# EAGLE schematic SELE_PROJECT (EAGLE 9.2.2)
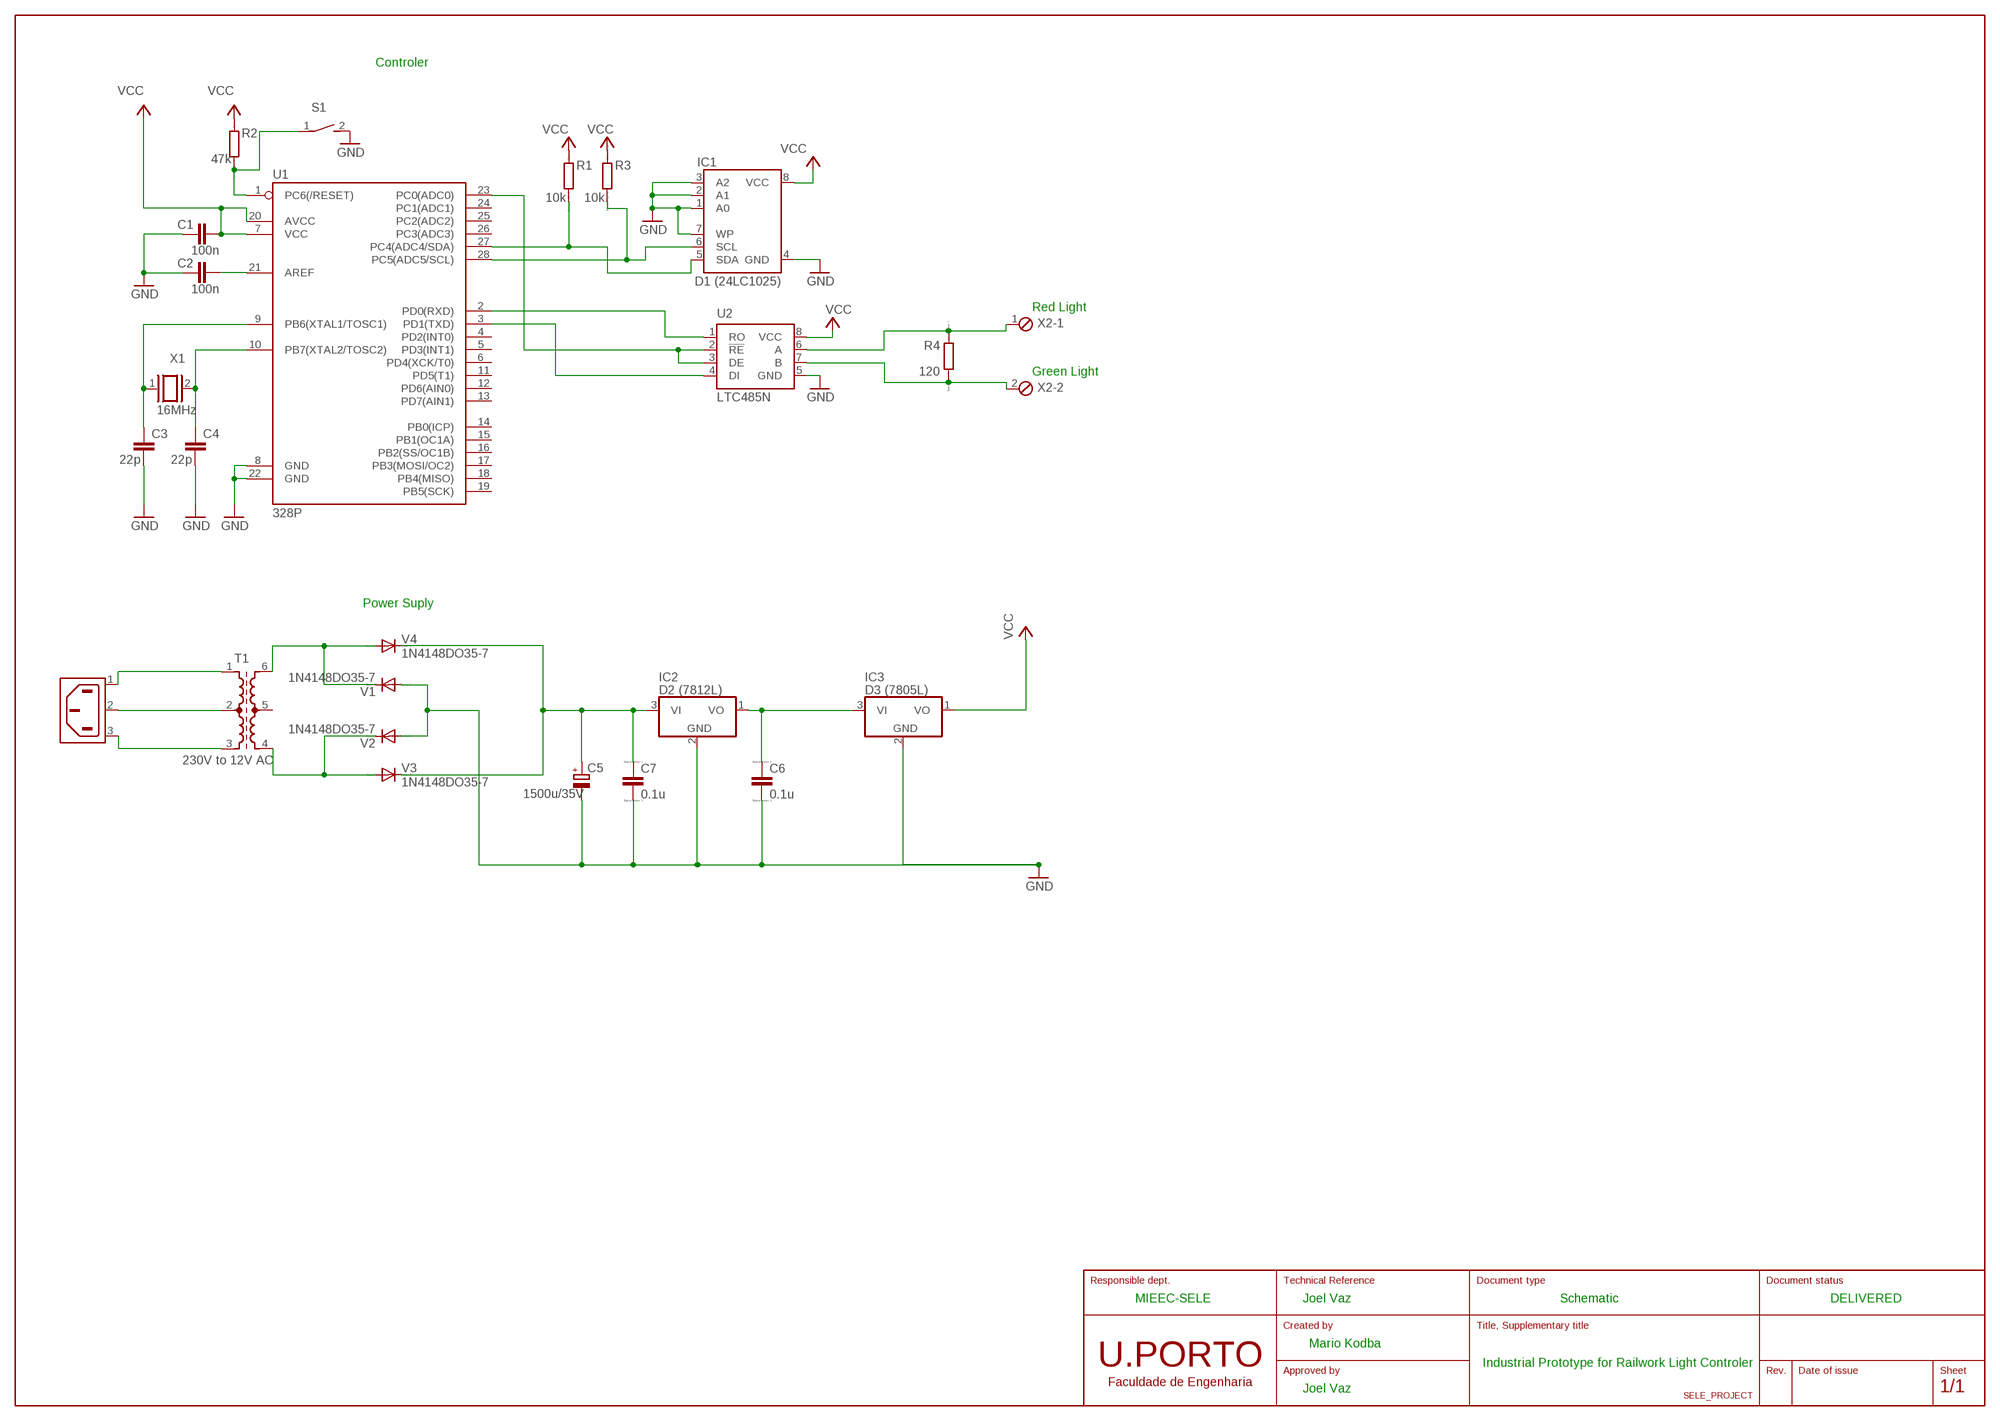
[diagram p0: schematic, sheet 1]

## Parts
C1  100n  C2,5-3  [C2.5-3]
C2  100n  C2,5-3  [C2.5-3]
C3  22p  C2,5-3  [C2.5-3]
C4  22p  C2,5-3  [C2.5-3]
C5  1500u/35V  CPOL-EU150CLZ-1010  [150CLZ-1010]
C6  0.1u  CC1210  [C1210]
C7  0.1u  CC1210  [C1210]
IC1  D1 (24LC1025)  AT24CP  [DIL08]
IC2  D2 (7812L)  7812L  [TO92]
IC3  D3 (7805L)  7805L  [TO92]
R1  10k  R  [R0805]
R2  47k  R  [R0805]
R3  10k  R  [R0805]
R4  120  R  [R0805]
S1  DS01E  [DS-01]
T1  230V to 12V AC  SM-EP7  [SM-EP7]
U1  328P  ATMEGA328P-PDIP  [MICROCONTROLLER_DIP28]
U2  LTC485N  [DIL08]
V1  1N4148DO35-7  [DO35-7]
V2  1N4148DO35-7  [DO35-7]
V3  1N4148DO35-7  [DO35-7]
V4  1N4148DO35-7  [DO35-7]
X1  16MHz  XTAL  [Q]
X2  MPT2  [2POL254]
X4  6ESRM-P  [6ESRM-P]

## Nets
GND: C1.1 C2.1 C3.2 C4.2 C5.- C6.2 C7.2 IC1.1(A0) IC1.2(A1) IC1.3(A2) IC1.4(GND) IC1.7(WP) IC2.2(GND) IC3.2(GND) S1.2 U1.8(GND) U1.22(GND) U2.5(GND) V1.A V2.A
N$1: C4.1 U1.10(PB7(XTAL2/TOSC2)) X1.2
N$2: U1.2(PD0(RXD)) U2.1(RO)
N$3: IC1.5(SDA) R1.2 U1.27(PC4(ADC4/SDA))
N$4: U1.3(PD1(TXD)) U2.4(DI)
N$5: IC1.6(SCL) R3.2 U1.28(PC5(ADC5/SCL))
N$6: R4.1 U2.6(A) X2.1
N$7: U1.23(PC0(ADC0)) U2.2(!RE) U2.3(DE)
N$8: R2.2 S1.1 U1.1(PC6(/RESET))
N$9: R4.2 U2.7(B) X2.2
N$10: C2.2 U1.21(AREF)
N$11: T1.6 V1.C V4.A
N$12: T1.4 V2.C V3.A
N$13: T1.1 X4.1(AC1)
N$14: T1.3 X4.3(AC2)
N$16: C5.+ C7.1 IC2.3(VI) V3.C V4.C
N$17: T1.2 X4.2(SH)
N$18: C6.1 IC2.1(VO) IC3.3(VI)
VCC: C1.2 IC1.8(VCC) IC3.1(VO) R1.1 R2.1 R3.1 U1.7(VCC) U1.20(AVCC) U2.8(VCC)
X1: C3.1 U1.9(PB6(XTAL1/TOSC1)) X1.1
Unconnected: T1.5 U1.4(PD2(INT0)) U1.5(PD3(INT1)) U1.6(PD4(XCK/T0)) U1.11(PD5(T1)) U1.12(PD6(AIN0)) U1.13(PD7(AIN1)) U1.14(PB0(ICP)) U1.15(PB1(OC1A)) U1.16(PB2(SS/OC1B)) U1.17(PB3(MOSI/OC2)) U1.18(PB4(MISO)) U1.19(PB5(SCK)) U1.24(PC1(ADC1)) U1.25(PC2(ADC2)) U1.26(PC3(ADC3))

## Notes on the sheet
- Controler
- Red Light
- Green Light
- Power Suply
- MIEEC-SELE | Joel Vaz | Schematic | DELIVERED
- Mario Kodba
- Industrial Prototype for Railwork Light Controler
- Joel Vaz

## Library data of the parts
C1-C4 = capacitor-wima:C: CAPACITOR naming: grid - package width
C5 = rcl:CPOL-EU: POLARIZED CAPACITOR, European symbol; SPICEPREFIX: C
C6 C7 = eagle-ltspice:C: CAPACITOR, European symbol; SPICEMODEL: NONE; SPICEPREFIX: C
IC1 = atmel:AT24C*: 2-wire serial EEPROM; MPN: AT24C1024BW-SH-B; OC_FARNELL: 1362646; OC_NEWARK: 03P2044
IC2 IC3 = linear:78*: Positive VOLTAGE REGULATOR Source: http://cache.national.com/ds/LM/LM78L05.pdf http://www.fairchildsemi.com/ds/LM/LM7805.pdf
R1-R4 = eagle-ltspice:R: RESISTOR, European symbol; SPICEMODEL: NONE; SPICEPREFIX: R
S1 = switch-dil:DS01E: DIL/CODE SWITCH; OC_FARNELL: unknown; OC_NEWARK: unknown
T1 = inductor-neosid:SM-EP: TRANSFORMER SMD converter and transformer acc. to customer specification; OC_FARNELL: unknown; OC_NEWARK: unknown
U1 = SBMI-SELE:ATMEGA328P-PDIP: Atmel 328P Through hole ATMEGA328P uC used in the Arduino 32kb flash, 1k EEPROM, 2k SRAM Datasheet <http://www.sparkfun.com/datasheets/Components/SMD/ATMega328.pdf> SparkFun Products Storefront component: AVR 28 Pin 20MHz 32K 6A/D - ATMega328P <https://www.sparkfun.com/products/9061> (COM-09061) SparkFun Simon Says - Through-Hole Soldering Kit <https://www.sparkfun.com/products/10547> (KIT-10547) SparkFun Learn to Solder - Simon Says <https://www.sparkfun.com/products/13708> (KIT-13708) SparkFun BigTime Watch Kit <https://www.sparkfun.com/products/11734> (KIT-11734) SparkFun ClockIt <https://www.sparkfun.com/products/10930> (KIT-10930) SparkFun Serial Enabled LCD Kit <https://www.sparkfun.com/products/10097> (LCD-10097) SparkFun Simon Tilts - Through Hole Soldering Kit <https://www.sparkfun.com/products/12634> (KIT-12634) SparkFun Frequency Counter Kit <https://www.sparkfun.com/products/10140> (KIT-10140) FabFM Radio Kit <https://www.sparkfun.com/products/11043> (KIT-11043) SparkFun Binary Blaster Kit <https://www.sparkfun.com/products/12037> (KIT-12037) SparkFun Metro-Gnome <https://www.sparkfun.com/products/9236> (KIT-09236) ATmega328 with Arduino Optiboot (Uno) <https://www.sparkfun.com/products/10524> (DEV-10524); PROD_ID: IC-09136
U2 = linear-technology:LTC485: Low Power RS485 Interface Transceiver Source: http://www.linear.com/pc/downloadDocument.do?navId=H0,C1,C1007,C1017,P2064,D1718; OC_FARNELL: unknown; OC_NEWARK: unknown
V1-V4 = diode:1N4148: DIODE high speed (Philips)
X1 = special:XTAL: CRYSTAL
X2 = con-phoenix-254:MPT2: PHOENIX CONNECTOR; OC_FARNELL: unknown; OC_NEWARK: unknown
X4 = con-tycoelectronics:6ESRM-P: AC Connector 120/250 VAC Source: http://catalog.tycoelectronics.com .. ENG_DS_1654001_1099_SR_0406.pdf; MF: TYCO ELECTRONICS; MPN: 6ESRM-P; OC_FARNELL: unknown; OC_NEWARK: 87F1821